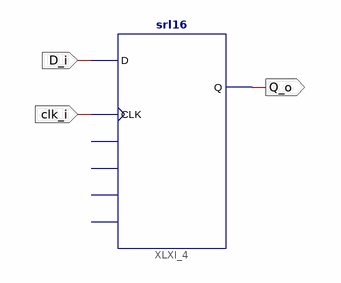
[diagram p0: schematic sheet 1]
// Xilinx ISE schematic ShiftRegForFilter.sch (spartan3e) as structural Verilog: 1 symbols, 3 ports
module ShiftRegForFilter (
  input  D_i,
  input  clk_i,
  output Q_o
);

  srl16 XLXI_4 (.CLK(clk_i), .D(D_i), .Q(Q_o));  // open: A0, A1, A2, A3
endmodule
